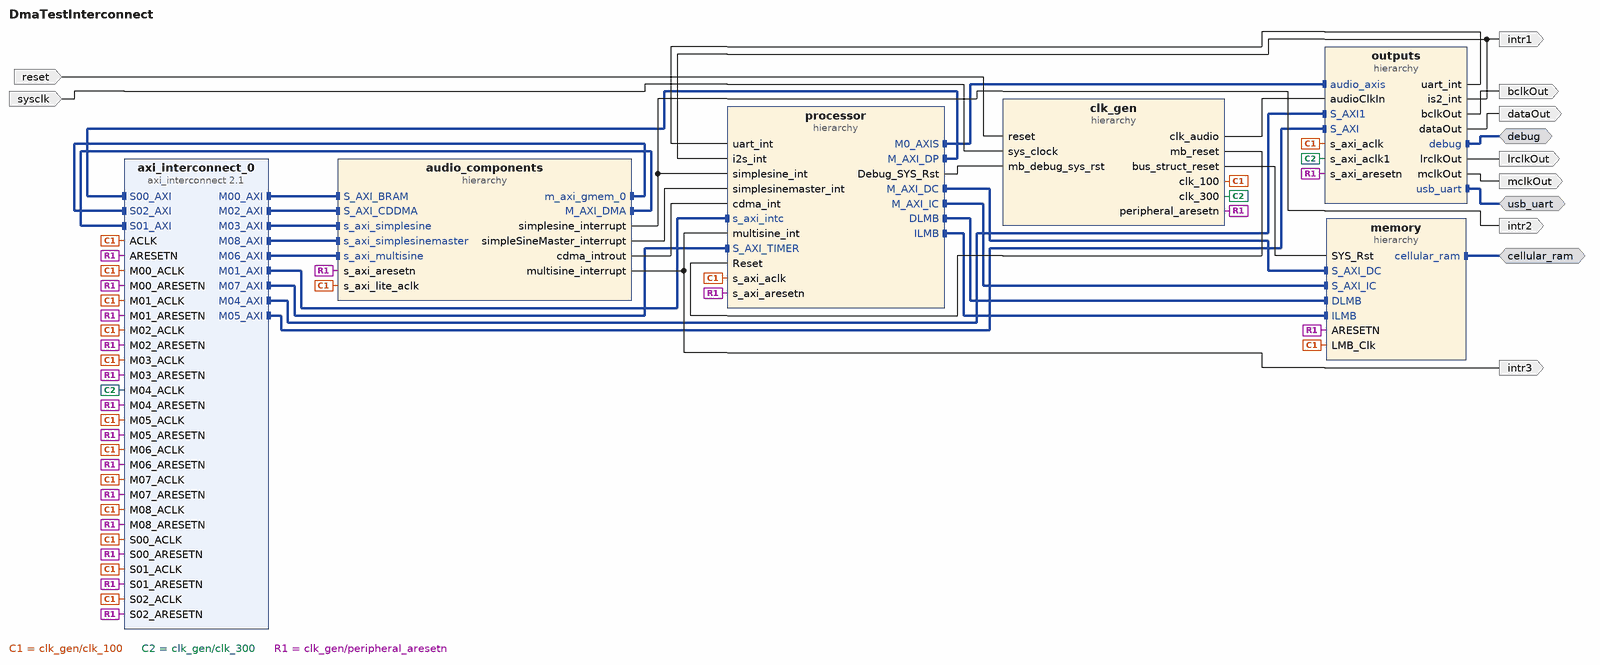
[diagram p0: block diagram of the top level]
# Vivado block design DmaTestInterconnect, xc7a35tcpg236-1, Vivado 2024.2
create_bd_design DmaTestInterconnect

create_bd_intf_port -mode Master -vlnv xilinx.com:interface:uart_rtl:1.0 usb_uart
create_bd_intf_port -mode Master -vlnv xilinx.com:interface:emc_rtl:1.0 cellular_ram
create_bd_intf_port -mode Master -vlnv xilinx.com:interface:gpio_rtl:1.0 debug
create_bd_port -dir I -type rst reset
set_property -dict {CONFIG.POLARITY ACTIVE_HIGH} [get_bd_ports reset]
create_bd_port -dir I -type clk sysclk
set_property -dict {CONFIG.FREQ_HZ 12000000 CONFIG.PHASE 0.0} [get_bd_ports sysclk]
create_bd_port -dir O mclkOut
create_bd_port -dir O bclkOut
create_bd_port -dir O lrclkOut
create_bd_port -dir O dataOut
create_bd_port -dir O intr1
create_bd_port -dir O intr2
create_bd_port -dir O intr3

create_bd_cell -type hier memory
create_bd_cell -type hier audio_components
create_bd_cell -type hier clk_gen
create_bd_cell -type ip -vlnv xilinx.com:ip:axi_interconnect:2.1 axi_interconnect_0
set_property -dict {CONFIG.ENABLE_ADVANCED_OPTIONS 1 CONFIG.NUM_MI 9 CONFIG.NUM_SI 3} [get_bd_cells axi_interconnect_0]
create_bd_cell -type hier outputs
create_bd_cell -type hier processor

# ---- hierarchy /memory ----
current_bd_instance /memory
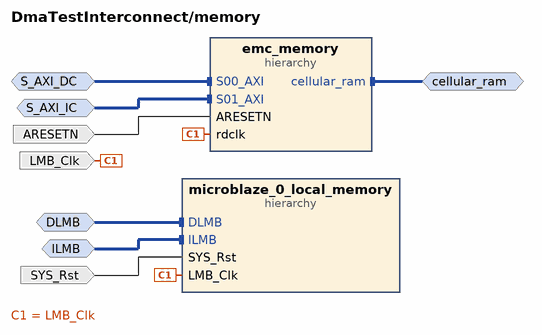
[diagram p1: block diagram inside /memory]
create_bd_intf_pin -mode Master -vlnv xilinx.com:interface:emc_rtl:1.0 cellular_ram
create_bd_intf_pin -mode Slave -vlnv xilinx.com:interface:aximm_rtl:1.0 S_AXI_DC
create_bd_intf_pin -mode Slave -vlnv xilinx.com:interface:aximm_rtl:1.0 S_AXI_IC
create_bd_intf_pin -mode MirroredMaster -vlnv xilinx.com:interface:lmb_rtl:1.0 DLMB
create_bd_intf_pin -mode MirroredMaster -vlnv xilinx.com:interface:lmb_rtl:1.0 ILMB
create_bd_pin -dir I -type clk LMB_Clk
create_bd_pin -dir I -type rst ARESETN
create_bd_pin -dir I -type rst SYS_Rst

create_bd_cell -type hier emc_memory
create_bd_cell -type hier microblaze_0_local_memory

# ---- hierarchy /memory/emc_memory ----
current_bd_instance /memory/emc_memory
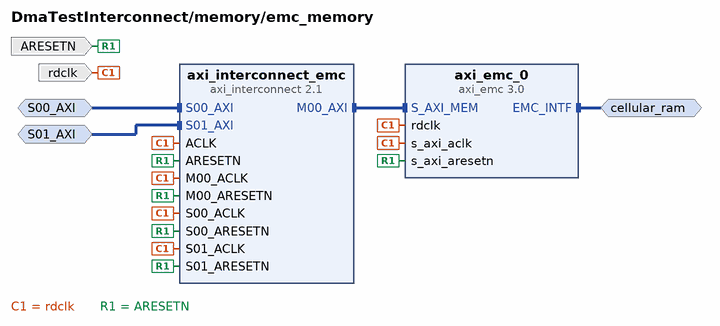
[diagram p2: block diagram inside /memory/emc_memory]
create_bd_intf_pin -mode Master -vlnv xilinx.com:interface:emc_rtl:1.0 cellular_ram
create_bd_intf_pin -mode Slave -vlnv xilinx.com:interface:aximm_rtl:1.0 S00_AXI
create_bd_intf_pin -mode Slave -vlnv xilinx.com:interface:aximm_rtl:1.0 S01_AXI
create_bd_pin -dir I -type clk rdclk
create_bd_pin -dir I -type rst ARESETN

create_bd_cell -type ip -vlnv xilinx.com:ip:axi_emc:3.0 axi_emc_0
set_property -dict {CONFIG.EMC_BOARD_INTERFACE cellular_ram CONFIG.USE_BOARD_FLOW true} [get_bd_cells axi_emc_0]
create_bd_cell -type ip -vlnv xilinx.com:ip:axi_interconnect:2.1 axi_interconnect_emc
set_property -dict {CONFIG.NUM_MI 1 CONFIG.NUM_SI 2} [get_bd_cells axi_interconnect_emc]

# ---- hierarchy /memory/microblaze_0_local_memory ----
current_bd_instance /memory/microblaze_0_local_memory
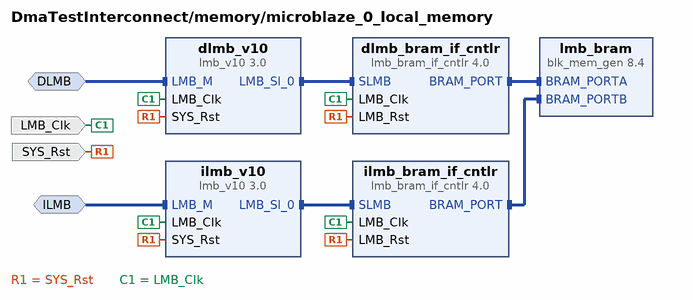
[diagram p3: block diagram inside /memory/microblaze_0_local_memory]
create_bd_intf_pin -mode MirroredMaster -vlnv xilinx.com:interface:lmb_rtl:1.0 DLMB
create_bd_intf_pin -mode MirroredMaster -vlnv xilinx.com:interface:lmb_rtl:1.0 ILMB
create_bd_pin -dir I -type clk LMB_Clk
create_bd_pin -dir I -type rst SYS_Rst

create_bd_cell -type ip -vlnv xilinx.com:ip:lmb_v10:3.0 dlmb_v10
create_bd_cell -type ip -vlnv xilinx.com:ip:lmb_v10:3.0 ilmb_v10
create_bd_cell -type ip -vlnv xilinx.com:ip:lmb_bram_if_cntlr:4.0 dlmb_bram_if_cntlr
set_property -dict {CONFIG.C_ECC 0 CONFIG.C_NUM_LMB 1} [get_bd_cells dlmb_bram_if_cntlr]
create_bd_cell -type ip -vlnv xilinx.com:ip:lmb_bram_if_cntlr:4.0 ilmb_bram_if_cntlr
set_property -dict {CONFIG.C_ECC 0} [get_bd_cells ilmb_bram_if_cntlr]
create_bd_cell -type ip -vlnv xilinx.com:ip:blk_mem_gen:8.4 lmb_bram
set_property -dict {CONFIG.Memory_Type True_Dual_Port_RAM CONFIG.use_bram_block BRAM_Controller} [get_bd_cells lmb_bram]

# ---- hierarchy /audio_components ----
current_bd_instance /audio_components
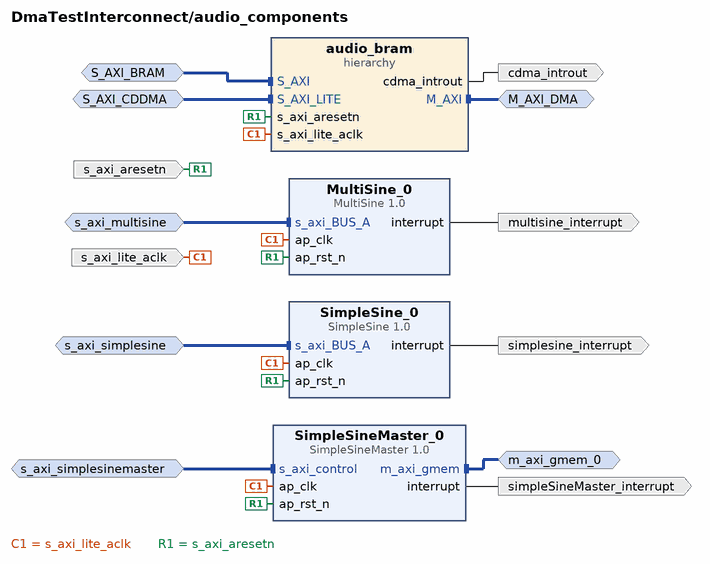
[diagram p4: block diagram inside /audio_components]
create_bd_intf_pin -mode Slave -vlnv xilinx.com:interface:aximm_rtl:1.0 s_axi_simplesine
create_bd_intf_pin -mode Master -vlnv xilinx.com:interface:aximm_rtl:1.0 M_AXI_DMA
create_bd_intf_pin -mode Slave -vlnv xilinx.com:interface:aximm_rtl:1.0 S_AXI_CDDMA
create_bd_intf_pin -mode Slave -vlnv xilinx.com:interface:aximm_rtl:1.0 S_AXI_BRAM
create_bd_intf_pin -mode Slave -vlnv xilinx.com:interface:aximm_rtl:1.0 s_axi_multisine
create_bd_intf_pin -mode Master -vlnv xilinx.com:interface:aximm_rtl:1.0 m_axi_gmem_0
create_bd_intf_pin -mode Slave -vlnv xilinx.com:interface:aximm_rtl:1.0 s_axi_simplesinemaster
create_bd_pin -dir I -type clk s_axi_lite_aclk
create_bd_pin -dir I -type rst s_axi_aresetn
create_bd_pin -dir O -type intr simplesine_interrupt
create_bd_pin -dir O -type intr cdma_introut
create_bd_pin -dir O -type intr multisine_interrupt
create_bd_pin -dir O simpleSineMaster_interrupt

create_bd_cell -type ip -vlnv xilinx.com:hls:SimpleSine:1.0 SimpleSine_0
create_bd_cell -type hier audio_bram
create_bd_cell -type ip -vlnv xilinx.com:hls:MultiSine:1.0 MultiSine_0
create_bd_cell -type ip -vlnv xilinx.com:hls:SimpleSineMaster:1.0 SimpleSineMaster_0

# ---- hierarchy /audio_components/audio_bram ----
current_bd_instance /audio_components/audio_bram
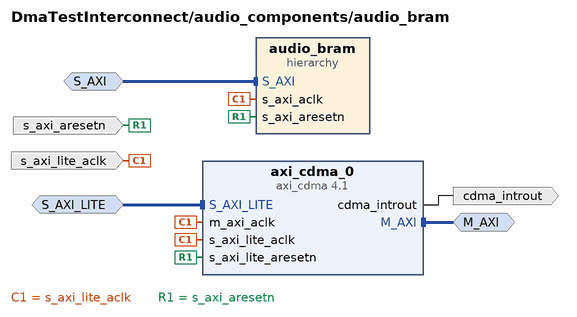
[diagram p5: block diagram inside /audio_components/audio_bram]
create_bd_intf_pin -mode Master -vlnv xilinx.com:interface:aximm_rtl:1.0 M_AXI
create_bd_intf_pin -mode Slave -vlnv xilinx.com:interface:aximm_rtl:1.0 S_AXI_LITE
create_bd_intf_pin -mode Slave -vlnv xilinx.com:interface:aximm_rtl:1.0 S_AXI
create_bd_pin -dir I -type clk s_axi_lite_aclk
create_bd_pin -dir I -type rst s_axi_aresetn
create_bd_pin -dir O -type intr cdma_introut

create_bd_cell -type ip -vlnv xilinx.com:ip:axi_cdma:4.1 axi_cdma_0
set_property -dict {CONFIG.C_INCLUDE_SG 0} [get_bd_cells axi_cdma_0]
create_bd_cell -type hier audio_bram

# ---- hierarchy /audio_components/audio_bram/audio_bram ----
current_bd_instance /audio_components/audio_bram/audio_bram
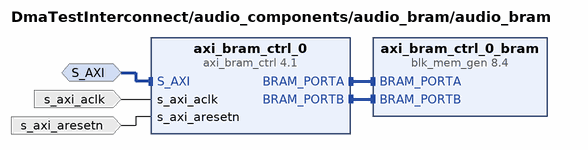
[diagram p6: block diagram inside /audio_components/audio_bram/audio_bram]
create_bd_intf_pin -mode Slave -vlnv xilinx.com:interface:aximm_rtl:1.0 S_AXI
create_bd_pin -dir I -type clk s_axi_aclk
create_bd_pin -dir I -type rst s_axi_aresetn

create_bd_cell -type ip -vlnv xilinx.com:ip:axi_bram_ctrl:4.1 axi_bram_ctrl_0
create_bd_cell -type ip -vlnv xilinx.com:ip:blk_mem_gen:8.4 axi_bram_ctrl_0_bram
set_property -dict {CONFIG.Memory_Type True_Dual_Port_RAM} [get_bd_cells axi_bram_ctrl_0_bram]

# ---- hierarchy /clk_gen ----
current_bd_instance /clk_gen
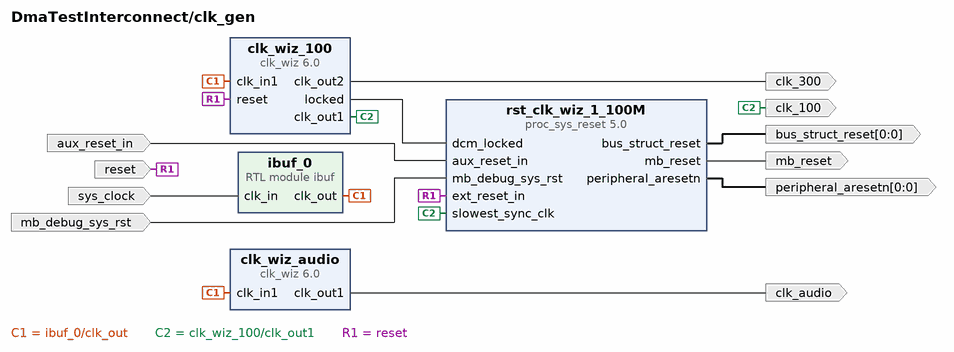
[diagram p7: block diagram inside /clk_gen]
create_bd_pin -dir I -type rst reset
create_bd_pin -dir O -type clk clk_100
create_bd_pin -dir I -type clk sys_clock
create_bd_pin -dir I -type rst mb_debug_sys_rst
create_bd_pin -dir O -type rst mb_reset
create_bd_pin -dir O -from 0 -to 0 -type rst bus_struct_reset
create_bd_pin -dir O -from 0 -to 0 -type rst peripheral_aresetn
create_bd_pin -dir O -type clk clk_audio
create_bd_pin -dir I -type rst aux_reset_in
create_bd_pin -dir O -type clk clk_300

create_bd_cell -type ip -vlnv xilinx.com:ip:clk_wiz:6.0 clk_wiz_100
set_property -dict [list \
  CONFIG.CLKIN1_JITTER_PS 833.33 \
  CONFIG.CLKOUT1_JITTER 571.161 \
  CONFIG.CLKOUT1_PHASE_ERROR 613.025 \
  CONFIG.CLKOUT2_JITTER 496.412 \
  CONFIG.CLKOUT2_PHASE_ERROR 613.025 \
  CONFIG.CLKOUT2_REQUESTED_OUT_FREQ 300.000 \
  CONFIG.CLKOUT2_USED true \
  CONFIG.CLK_IN1_BOARD_INTERFACE Custom \
  CONFIG.MMCM_CLKFBOUT_MULT_F 50.000 \
  CONFIG.MMCM_CLKIN1_PERIOD 83.333 \
  CONFIG.MMCM_CLKIN2_PERIOD 10.0 \
  CONFIG.MMCM_CLKOUT0_DIVIDE_F 6.000 \
  CONFIG.MMCM_CLKOUT1_DIVIDE 2 \
  CONFIG.NUM_OUT_CLKS 2 \
  CONFIG.PRIM_SOURCE No_buffer \
  CONFIG.RESET_BOARD_INTERFACE reset \
  CONFIG.USE_BOARD_FLOW true \
] [get_bd_cells clk_wiz_100]
create_bd_cell -type module -reference ibuf ibuf_0
create_bd_cell -type ip -vlnv xilinx.com:ip:proc_sys_reset:5.0 rst_clk_wiz_1_100M
set_property -dict {CONFIG.RESET_BOARD_INTERFACE reset CONFIG.USE_BOARD_FLOW true} [get_bd_cells rst_clk_wiz_1_100M]
create_bd_cell -type ip -vlnv xilinx.com:ip:clk_wiz:6.0 clk_wiz_audio
set_property -dict [list \
  CONFIG.CLKIN1_JITTER_PS 833.33 \
  CONFIG.CLKOUT1_JITTER 598.000 \
  CONFIG.CLKOUT1_PHASE_ERROR 693.818 \
  CONFIG.CLKOUT1_REQUESTED_OUT_FREQ 24.576 \
  CONFIG.MMCM_CLKFBOUT_MULT_F 64.000 \
  CONFIG.MMCM_CLKIN1_PERIOD 83.333 \
  CONFIG.MMCM_CLKIN2_PERIOD 10.0 \
  CONFIG.MMCM_CLKOUT0_DIVIDE_F 31.250 \
  CONFIG.PRIM_IN_FREQ 12 \
  CONFIG.PRIM_SOURCE No_buffer \
  CONFIG.USE_LOCKED false \
  CONFIG.USE_RESET false \
] [get_bd_cells clk_wiz_audio]

# ---- hierarchy /outputs ----
current_bd_instance /outputs
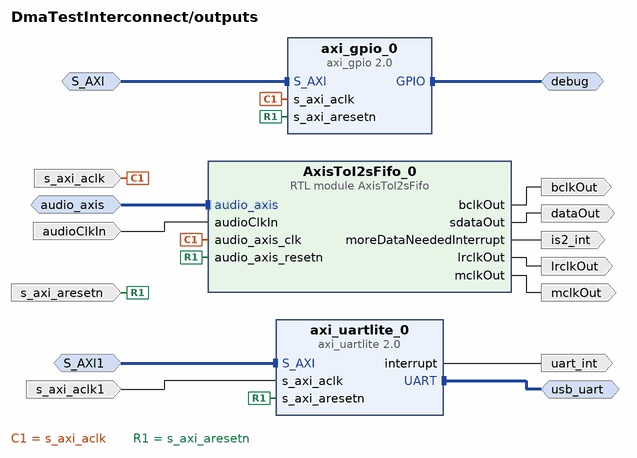
[diagram p8: block diagram inside /outputs]
create_bd_intf_pin -mode Slave -vlnv xilinx.com:interface:axis_rtl:1.0 audio_axis
create_bd_intf_pin -mode Slave -vlnv xilinx.com:interface:aximm_rtl:1.0 S_AXI
create_bd_intf_pin -mode Master -vlnv xilinx.com:interface:gpio_rtl:1.0 debug
create_bd_intf_pin -mode Slave -vlnv xilinx.com:interface:aximm_rtl:1.0 S_AXI1
create_bd_intf_pin -mode Master -vlnv xilinx.com:interface:uart_rtl:1.0 usb_uart
create_bd_pin -dir I -type clk s_axi_aclk
create_bd_pin -dir I -type rst s_axi_aresetn
create_bd_pin -dir I audioClkIn
create_bd_pin -dir O mclkOut
create_bd_pin -dir O bclkOut
create_bd_pin -dir O lrclkOut
create_bd_pin -dir O dataOut
create_bd_pin -dir O is2_int
create_bd_pin -dir I -type clk s_axi_aclk1
create_bd_pin -dir O -type intr uart_int

create_bd_cell -type module -reference AxisToI2sFifo AxisToI2sFifo_0
set_property -dict {CONFIG.FIFO_SAMPLE_DEPTH 256 CONFIG.FIFO_SAMPLE_MAINTAIN_DEPTH 96} [get_bd_cells AxisToI2sFifo_0]
create_bd_cell -type ip -vlnv xilinx.com:ip:axi_gpio:2.0 axi_gpio_0
set_property -dict {CONFIG.C_GPIO_WIDTH 8 CONFIG.GPIO_BOARD_INTERFACE Custom CONFIG.USE_BOARD_FLOW true} [get_bd_cells axi_gpio_0]
create_bd_cell -type ip -vlnv xilinx.com:ip:axi_uartlite:2.0 axi_uartlite_0
set_property -dict [list \
  CONFIG.C_BAUDRATE 921600 \
  CONFIG.C_S_AXI_ACLK_FREQ_HZ_d 300.0 \
  CONFIG.UARTLITE_BOARD_INTERFACE usb_uart \
  CONFIG.USE_BOARD_FLOW true \
] [get_bd_cells axi_uartlite_0]

# ---- hierarchy /processor ----
current_bd_instance /processor
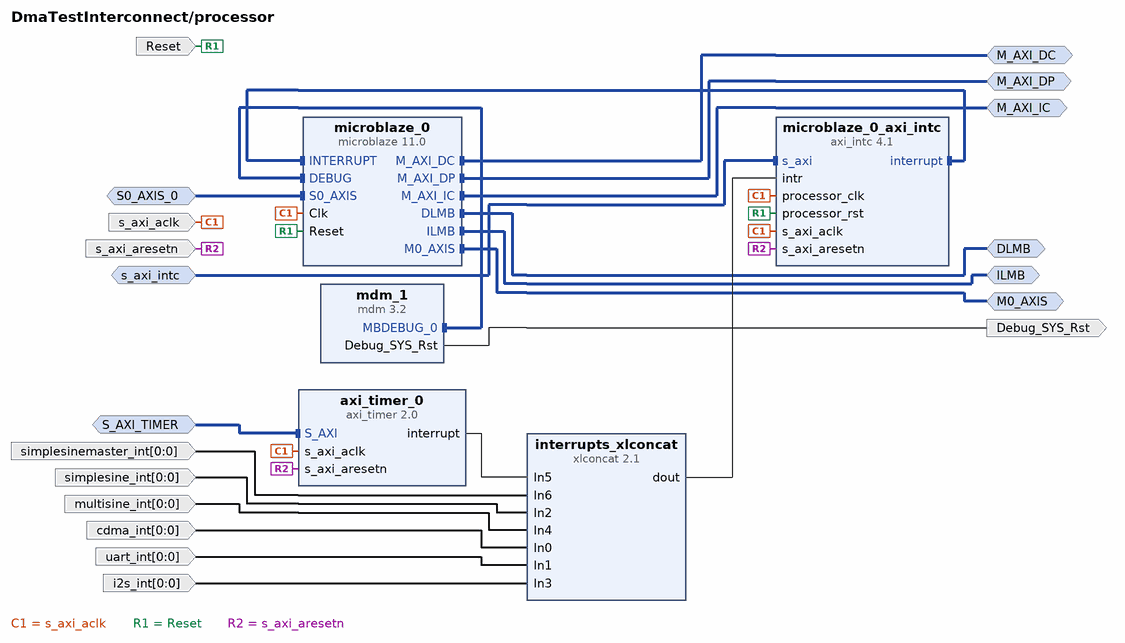
[diagram p9: block diagram inside /processor]
create_bd_intf_pin -mode Slave -vlnv xilinx.com:interface:aximm_rtl:1.0 s_axi_intc
create_bd_intf_pin -mode Slave -vlnv xilinx.com:interface:aximm_rtl:1.0 S_AXI_TIMER
create_bd_intf_pin -mode Master -vlnv xilinx.com:interface:lmb_rtl:1.0 DLMB
create_bd_intf_pin -mode Master -vlnv xilinx.com:interface:lmb_rtl:1.0 ILMB
create_bd_intf_pin -mode Master -vlnv xilinx.com:interface:aximm_rtl:1.0 M_AXI_DP
create_bd_intf_pin -mode Master -vlnv xilinx.com:interface:axis_rtl:1.0 M0_AXIS
create_bd_intf_pin -mode Master -vlnv xilinx.com:interface:aximm_rtl:1.0 M_AXI_DC
create_bd_intf_pin -mode Master -vlnv xilinx.com:interface:aximm_rtl:1.0 M_AXI_IC
create_bd_intf_pin -mode Slave -vlnv xilinx.com:interface:axis_rtl:1.0 S0_AXIS_0
create_bd_pin -dir I -type clk s_axi_aclk
create_bd_pin -dir I -type rst s_axi_aresetn
create_bd_pin -dir I -type rst Reset
create_bd_pin -dir O -type rst Debug_SYS_Rst
create_bd_pin -dir I -from 0 -to 0 cdma_int
create_bd_pin -dir I -from 0 -to 0 uart_int
create_bd_pin -dir I -from 0 -to 0 simplesine_int
create_bd_pin -dir I -from 0 -to 0 i2s_int
create_bd_pin -dir I -from 0 -to 0 multisine_int
create_bd_pin -dir I -from 0 -to 0 simplesinemaster_int

create_bd_cell -type ip -vlnv xilinx.com:ip:axi_intc:4.1 microblaze_0_axi_intc
set_property -dict {CONFIG.C_HAS_FAST 1} [get_bd_cells microblaze_0_axi_intc]
create_bd_cell -type ip -vlnv xilinx.com:ip:mdm:3.2 mdm_1
create_bd_cell -type ip -vlnv xilinx.com:ip:axi_timer:2.0 axi_timer_0
create_bd_cell -type ip -vlnv xilinx.com:ip:xlconcat:2.1 interrupts_xlconcat
set_property -dict {CONFIG.NUM_PORTS 7} [get_bd_cells interrupts_xlconcat]
create_bd_cell -type ip -vlnv xilinx.com:ip:microblaze:11.0 microblaze_0
set_property -dict [list \
  CONFIG.C_CACHE_BYTE_SIZE 32768 \
  CONFIG.C_DCACHE_BYTE_SIZE 32768 \
  CONFIG.C_DCACHE_USE_WRITEBACK 1 \
  CONFIG.C_DCACHE_VICTIMS 8 \
  CONFIG.C_DEBUG_ENABLED 2 \
  CONFIG.C_DEBUG_EXTERNAL_TRACE 0 \
  CONFIG.C_DEBUG_PROFILE_SIZE 16384 \
  CONFIG.C_DIV_ZERO_EXCEPTION 1 \
  CONFIG.C_D_AXI 1 \
  CONFIG.C_D_LMB 1 \
  CONFIG.C_ENABLE_CONVERSION 0 \
  CONFIG.C_FSL_LINKS 1 \
  CONFIG.C_ICACHE_STREAMS 1 \
  CONFIG.C_ICACHE_VICTIMS 8 \
  CONFIG.C_ILL_OPCODE_EXCEPTION 1 \
  CONFIG.C_I_LMB 1 \
  CONFIG.C_M_AXI_D_BUS_EXCEPTION 1 \
  CONFIG.C_M_AXI_I_BUS_EXCEPTION 1 \
  CONFIG.C_NUMBER_OF_PC_BRK 8 \
  CONFIG.C_NUMBER_OF_WR_ADDR_BRK 2 \
  CONFIG.C_OPCODE_0x0_ILLEGAL 1 \
  CONFIG.C_UNALIGNED_EXCEPTIONS 1 \
  CONFIG.C_USE_BARREL 1 \
  CONFIG.C_USE_BRANCH_TARGET_CACHE 1 \
  CONFIG.C_USE_DCACHE 1 \
  CONFIG.C_USE_DIV 1 \
  CONFIG.C_USE_FPU 2 \
  CONFIG.C_USE_HW_MUL 1 \
  CONFIG.C_USE_ICACHE 1 \
  CONFIG.C_USE_MSR_INSTR 1 \
  CONFIG.C_USE_PCMP_INSTR 1 \
  CONFIG.C_USE_STACK_PROTECTION 1 \
] [get_bd_cells microblaze_0]

# ---- connections ----

current_bd_instance /memory
connect_bd_intf_net -intf_net axi_emc_0_EMC_INTF [get_bd_intf_pins cellular_ram] [get_bd_intf_pins emc_memory/cellular_ram]
connect_bd_intf_net -intf_net microblaze_0_M_AXI_DC [get_bd_intf_pins S_AXI_DC] [get_bd_intf_pins emc_memory/S00_AXI]
connect_bd_intf_net -intf_net microblaze_0_M_AXI_IC [get_bd_intf_pins S_AXI_IC] [get_bd_intf_pins emc_memory/S01_AXI]
connect_bd_intf_net -intf_net microblaze_0_dlmb_1 [get_bd_intf_pins DLMB] [get_bd_intf_pins microblaze_0_local_memory/DLMB]
connect_bd_intf_net -intf_net microblaze_0_ilmb_1 [get_bd_intf_pins ILMB] [get_bd_intf_pins microblaze_0_local_memory/ILMB]
connect_bd_net -net microblaze_0_Clk [get_bd_pins LMB_Clk] [get_bd_pins microblaze_0_local_memory/LMB_Clk] [get_bd_pins emc_memory/rdclk]
connect_bd_net -net rst_clk_wiz_1_100M_bus_struct_reset [get_bd_pins SYS_Rst] [get_bd_pins microblaze_0_local_memory/SYS_Rst]
connect_bd_net -net rst_clk_wiz_1_100M_peripheral_aresetn [get_bd_pins ARESETN] [get_bd_pins emc_memory/ARESETN]

current_bd_instance /memory/emc_memory
connect_bd_intf_net [get_bd_intf_pins cellular_ram] [get_bd_intf_pins axi_emc_0/EMC_INTF]
connect_bd_intf_net -intf_net axi_interconnect_1_M00_AXI [get_bd_intf_pins axi_emc_0/S_AXI_MEM] [get_bd_intf_pins axi_interconnect_emc/M00_AXI]
connect_bd_intf_net -intf_net microblaze_0_M_AXI_DC [get_bd_intf_pins S00_AXI] [get_bd_intf_pins axi_interconnect_emc/S00_AXI]
connect_bd_intf_net -intf_net microblaze_0_M_AXI_IC [get_bd_intf_pins S01_AXI] [get_bd_intf_pins axi_interconnect_emc/S01_AXI]
connect_bd_net -net microblaze_0_Clk [get_bd_pins rdclk] \
  [get_bd_pins axi_emc_0/rdclk] [get_bd_pins axi_interconnect_emc/ACLK] [get_bd_pins axi_interconnect_emc/M00_ACLK] \
  [get_bd_pins axi_interconnect_emc/S00_ACLK] [get_bd_pins axi_interconnect_emc/S01_ACLK] [get_bd_pins axi_emc_0/s_axi_aclk]
connect_bd_net -net rst_clk_wiz_1_100M_peripheral_aresetn [get_bd_pins ARESETN] \
  [get_bd_pins axi_interconnect_emc/ARESETN] [get_bd_pins axi_interconnect_emc/M00_ARESETN] \
  [get_bd_pins axi_interconnect_emc/S00_ARESETN] [get_bd_pins axi_interconnect_emc/S01_ARESETN] \
  [get_bd_pins axi_emc_0/s_axi_aresetn]

current_bd_instance /memory/microblaze_0_local_memory
connect_bd_intf_net [get_bd_intf_pins ilmb_v10/LMB_Sl_0] [get_bd_intf_pins ilmb_bram_if_cntlr/SLMB]
connect_bd_intf_net -intf_net microblaze_0_dlmb [get_bd_intf_pins dlmb_v10/LMB_M] [get_bd_intf_pins DLMB]
connect_bd_intf_net -intf_net microblaze_0_dlmb_bus [get_bd_intf_pins dlmb_v10/LMB_Sl_0] [get_bd_intf_pins dlmb_bram_if_cntlr/SLMB]
connect_bd_intf_net -intf_net microblaze_0_dlmb_cntlr [get_bd_intf_pins dlmb_bram_if_cntlr/BRAM_PORT] [get_bd_intf_pins lmb_bram/BRAM_PORTA]
connect_bd_intf_net -intf_net microblaze_0_ilmb [get_bd_intf_pins ilmb_v10/LMB_M] [get_bd_intf_pins ILMB]
connect_bd_intf_net -intf_net microblaze_0_ilmb_cntlr [get_bd_intf_pins ilmb_bram_if_cntlr/BRAM_PORT] [get_bd_intf_pins lmb_bram/BRAM_PORTB]
connect_bd_net [get_bd_pins SYS_Rst] \
  [get_bd_pins dlmb_v10/SYS_Rst] [get_bd_pins dlmb_bram_if_cntlr/LMB_Rst] [get_bd_pins ilmb_v10/SYS_Rst] \
  [get_bd_pins ilmb_bram_if_cntlr/LMB_Rst]
connect_bd_net -net microblaze_0_Clk [get_bd_pins LMB_Clk] \
  [get_bd_pins dlmb_v10/LMB_Clk] [get_bd_pins dlmb_bram_if_cntlr/LMB_Clk] [get_bd_pins ilmb_v10/LMB_Clk] \
  [get_bd_pins ilmb_bram_if_cntlr/LMB_Clk]
set_property HDL_ATTRIBUTE.BMM_INFO_ADDRESS_SPACE {byte  0x00000000 32 > DmaTestInterconnect memory/microblaze_0_local_memory/lmb_bram} [get_bd_cells dlmb_bram_if_cntlr]
set_property HDL_ATTRIBUTE.KEEP_HIERARCHY yes [get_bd_cells dlmb_bram_if_cntlr]

current_bd_instance /audio_components
connect_bd_intf_net [get_bd_intf_pins SimpleSineMaster_0/m_axi_gmem] [get_bd_intf_pins m_axi_gmem_0]
connect_bd_intf_net [get_bd_intf_pins SimpleSineMaster_0/s_axi_control] [get_bd_intf_pins s_axi_simplesinemaster]
connect_bd_intf_net -intf_net axi_cdma_0_M_AXI [get_bd_intf_pins M_AXI_DMA] [get_bd_intf_pins audio_bram/M_AXI]
connect_bd_intf_net -intf_net axi_interconnect_0_M00_AXI [get_bd_intf_pins S_AXI_BRAM] [get_bd_intf_pins audio_bram/S_AXI]
connect_bd_intf_net -intf_net axi_interconnect_0_M02_AXI [get_bd_intf_pins S_AXI_CDDMA] [get_bd_intf_pins audio_bram/S_AXI_LITE]
connect_bd_intf_net -intf_net axi_interconnect_0_M03_AXI [get_bd_intf_pins s_axi_simplesine] [get_bd_intf_pins SimpleSine_0/s_axi_BUS_A]
connect_bd_intf_net [get_bd_intf_pins s_axi_multisine] [get_bd_intf_pins MultiSine_0/s_axi_BUS_A]
connect_bd_net [get_bd_pins MultiSine_0/interrupt] [get_bd_pins multisine_interrupt]
connect_bd_net [get_bd_pins SimpleSineMaster_0/interrupt] [get_bd_pins simpleSineMaster_interrupt]
connect_bd_net [get_bd_pins SimpleSine_0/interrupt] [get_bd_pins simplesine_interrupt]
connect_bd_net -net axi_cdma_0_cdma_introut [get_bd_pins audio_bram/cdma_introut] [get_bd_pins cdma_introut]
connect_bd_net -net microblaze_0_Clk [get_bd_pins s_axi_lite_aclk] \
  [get_bd_pins audio_bram/s_axi_lite_aclk] [get_bd_pins MultiSine_0/ap_clk] [get_bd_pins SimpleSine_0/ap_clk] \
  [get_bd_pins SimpleSineMaster_0/ap_clk]
connect_bd_net -net rst_clk_wiz_1_100M_peripheral_aresetn [get_bd_pins s_axi_aresetn] \
  [get_bd_pins audio_bram/s_axi_aresetn] [get_bd_pins MultiSine_0/ap_rst_n] [get_bd_pins SimpleSine_0/ap_rst_n] \
  [get_bd_pins SimpleSineMaster_0/ap_rst_n]

current_bd_instance /audio_components/audio_bram
connect_bd_intf_net [get_bd_intf_pins M_AXI] [get_bd_intf_pins axi_cdma_0/M_AXI]
connect_bd_intf_net -intf_net axi_interconnect_0_M00_AXI [get_bd_intf_pins S_AXI] [get_bd_intf_pins audio_bram/S_AXI]
connect_bd_intf_net -intf_net axi_interconnect_0_M02_AXI [get_bd_intf_pins S_AXI_LITE] [get_bd_intf_pins axi_cdma_0/S_AXI_LITE]
connect_bd_net [get_bd_pins axi_cdma_0/cdma_introut] [get_bd_pins cdma_introut]
connect_bd_net -net microblaze_0_Clk [get_bd_pins s_axi_lite_aclk] \
  [get_bd_pins axi_cdma_0/s_axi_lite_aclk] [get_bd_pins audio_bram/s_axi_aclk] [get_bd_pins axi_cdma_0/m_axi_aclk]
connect_bd_net -net rst_clk_wiz_1_100M_peripheral_aresetn [get_bd_pins s_axi_aresetn] \
  [get_bd_pins audio_bram/s_axi_aresetn] [get_bd_pins axi_cdma_0/s_axi_lite_aresetn]

current_bd_instance /audio_components/audio_bram/audio_bram
connect_bd_intf_net [get_bd_intf_pins axi_bram_ctrl_0_bram/BRAM_PORTA] [get_bd_intf_pins axi_bram_ctrl_0/BRAM_PORTA]
connect_bd_intf_net [get_bd_intf_pins axi_bram_ctrl_0_bram/BRAM_PORTB] [get_bd_intf_pins axi_bram_ctrl_0/BRAM_PORTB]
connect_bd_intf_net -intf_net axi_interconnect_0_M00_AXI [get_bd_intf_pins S_AXI] [get_bd_intf_pins axi_bram_ctrl_0/S_AXI]
connect_bd_net -net microblaze_0_Clk [get_bd_pins s_axi_aclk] [get_bd_pins axi_bram_ctrl_0/s_axi_aclk]
connect_bd_net -net rst_clk_wiz_1_100M_peripheral_aresetn [get_bd_pins s_axi_aresetn] [get_bd_pins axi_bram_ctrl_0/s_axi_aresetn]
set_property HDL_ATTRIBUTE.BMM_INFO_ADDRESS_SPACE {byte  0xC0000000 32 > DmaTestInterconnect audio_components/audio_bram/audio_bram/axi_bram_ctrl_0_bram} [get_bd_cells axi_bram_ctrl_0]
set_property HDL_ATTRIBUTE.KEEP_HIERARCHY yes [get_bd_cells axi_bram_ctrl_0]

current_bd_instance /clk_gen
connect_bd_net [get_bd_pins aux_reset_in] [get_bd_pins rst_clk_wiz_1_100M/aux_reset_in]
connect_bd_net -net clk_wiz_0_clk_out1 [get_bd_pins clk_wiz_audio/clk_out1] [get_bd_pins clk_audio]
connect_bd_net [get_bd_pins clk_wiz_100/clk_out2] [get_bd_pins clk_300]
connect_bd_net -net clk_wiz_1_locked [get_bd_pins clk_wiz_100/locked] [get_bd_pins rst_clk_wiz_1_100M/dcm_locked]
connect_bd_net [get_bd_pins ibuf_0/clk_out] [get_bd_pins clk_wiz_100/clk_in1] [get_bd_pins clk_wiz_audio/clk_in1]
connect_bd_net -net mdm_1_debug_sys_rst [get_bd_pins mb_debug_sys_rst] [get_bd_pins rst_clk_wiz_1_100M/mb_debug_sys_rst]
connect_bd_net -net microblaze_0_Clk [get_bd_pins clk_wiz_100/clk_out1] [get_bd_pins clk_100] [get_bd_pins rst_clk_wiz_1_100M/slowest_sync_clk]
connect_bd_net [get_bd_pins reset] [get_bd_pins rst_clk_wiz_1_100M/ext_reset_in] [get_bd_pins clk_wiz_100/reset]
connect_bd_net [get_bd_pins rst_clk_wiz_1_100M/bus_struct_reset] [get_bd_pins bus_struct_reset]
connect_bd_net [get_bd_pins rst_clk_wiz_1_100M/mb_reset] [get_bd_pins mb_reset]
connect_bd_net [get_bd_pins rst_clk_wiz_1_100M/peripheral_aresetn] [get_bd_pins peripheral_aresetn]
connect_bd_net [get_bd_pins sys_clock] [get_bd_pins ibuf_0/clk_in]

current_bd_instance /outputs
connect_bd_intf_net [get_bd_intf_pins debug] [get_bd_intf_pins axi_gpio_0/GPIO]
connect_bd_intf_net -intf_net axi_interconnect_0_M04_AXI [get_bd_intf_pins S_AXI1] [get_bd_intf_pins axi_uartlite_0/S_AXI]
connect_bd_intf_net -intf_net axi_interconnect_0_M05_AXI [get_bd_intf_pins S_AXI] [get_bd_intf_pins axi_gpio_0/S_AXI]
connect_bd_intf_net [get_bd_intf_pins usb_uart] [get_bd_intf_pins axi_uartlite_0/UART]
connect_bd_intf_net -intf_net processor_M0_AXIS [get_bd_intf_pins audio_axis] [get_bd_intf_pins AxisToI2sFifo_0/audio_axis]
connect_bd_net [get_bd_pins axi_uartlite_0/interrupt] [get_bd_pins uart_int]
connect_bd_net -net clk_gen_clk_100 [get_bd_pins s_axi_aclk] [get_bd_pins axi_gpio_0/s_axi_aclk] [get_bd_pins AxisToI2sFifo_0/audio_axis_clk]
connect_bd_net -net clk_gen_clk_300 [get_bd_pins s_axi_aclk1] [get_bd_pins axi_uartlite_0/s_axi_aclk]
connect_bd_net -net clk_gen_clk_audio [get_bd_pins audioClkIn] [get_bd_pins AxisToI2sFifo_0/audioClkIn]
connect_bd_net -net outputs_bclkOut_0 [get_bd_pins AxisToI2sFifo_0/bclkOut] [get_bd_pins bclkOut]
connect_bd_net -net outputs_lrclkOut_0 [get_bd_pins AxisToI2sFifo_0/lrclkOut] [get_bd_pins lrclkOut]
connect_bd_net -net outputs_mclkOut_2 [get_bd_pins AxisToI2sFifo_0/mclkOut] [get_bd_pins mclkOut]
connect_bd_net -net outputs_moreDataNeededInterrupt_0 [get_bd_pins AxisToI2sFifo_0/moreDataNeededInterrupt] [get_bd_pins is2_int]
connect_bd_net -net outputs_sdataOut_0 [get_bd_pins AxisToI2sFifo_0/sdataOut] [get_bd_pins dataOut]
connect_bd_net -net rst_clk_wiz_1_100M_peripheral_aresetn [get_bd_pins s_axi_aresetn] \
  [get_bd_pins axi_gpio_0/s_axi_aresetn] [get_bd_pins axi_uartlite_0/s_axi_aresetn] \
  [get_bd_pins AxisToI2sFifo_0/audio_axis_resetn]

current_bd_instance /processor
connect_bd_intf_net [get_bd_intf_pins microblaze_0/S0_AXIS] [get_bd_intf_pins S0_AXIS_0]
connect_bd_intf_net -intf_net axi_interconnect_0_M01_AXI [get_bd_intf_pins s_axi_intc] [get_bd_intf_pins microblaze_0_axi_intc/s_axi]
connect_bd_intf_net -intf_net interconnect_M07_AXI [get_bd_intf_pins S_AXI_TIMER] [get_bd_intf_pins axi_timer_0/S_AXI]
connect_bd_intf_net [get_bd_intf_pins M_AXI_DC] [get_bd_intf_pins microblaze_0/M_AXI_DC]
connect_bd_intf_net [get_bd_intf_pins M_AXI_DP] [get_bd_intf_pins microblaze_0/M_AXI_DP]
connect_bd_intf_net [get_bd_intf_pins M_AXI_IC] [get_bd_intf_pins microblaze_0/M_AXI_IC]
connect_bd_intf_net [get_bd_intf_pins mdm_1/MBDEBUG_0] [get_bd_intf_pins microblaze_0/DEBUG]
connect_bd_intf_net [get_bd_intf_pins DLMB] [get_bd_intf_pins microblaze_0/DLMB]
connect_bd_intf_net [get_bd_intf_pins ILMB] [get_bd_intf_pins microblaze_0/ILMB]
connect_bd_intf_net [get_bd_intf_pins microblaze_0_axi_intc/interrupt] [get_bd_intf_pins microblaze_0/INTERRUPT]
connect_bd_intf_net -intf_net processor_M0_AXIS [get_bd_intf_pins M0_AXIS] [get_bd_intf_pins microblaze_0/M0_AXIS]
connect_bd_net -net In6_0_1 [get_bd_pins simplesinemaster_int] [get_bd_pins interrupts_xlconcat/In6]
connect_bd_net -net SimpleSine_0_interrupt [get_bd_pins simplesine_int] [get_bd_pins interrupts_xlconcat/In2]
connect_bd_net -net audio_components_multisine_interrupt [get_bd_pins multisine_int] [get_bd_pins interrupts_xlconcat/In4]
connect_bd_net -net axi_cdma_0_cdma_introut [get_bd_pins cdma_int] [get_bd_pins interrupts_xlconcat/In0]
connect_bd_net [get_bd_pins axi_timer_0/interrupt] [get_bd_pins interrupts_xlconcat/In5]
connect_bd_net -net axi_uartlite_0_interrupt [get_bd_pins uart_int] [get_bd_pins interrupts_xlconcat/In1]
connect_bd_net -net clk_gen_clk_100 [get_bd_pins s_axi_aclk] \
  [get_bd_pins axi_timer_0/s_axi_aclk] [get_bd_pins microblaze_0/Clk] [get_bd_pins microblaze_0_axi_intc/processor_clk] \
  [get_bd_pins microblaze_0_axi_intc/s_axi_aclk]
connect_bd_net [get_bd_pins mdm_1/Debug_SYS_Rst] [get_bd_pins Debug_SYS_Rst]
connect_bd_net -net microblaze_0_intr [get_bd_pins interrupts_xlconcat/dout] [get_bd_pins microblaze_0_axi_intc/intr]
connect_bd_net -net outputs_moreDataNeededInterrupt_0 [get_bd_pins i2s_int] [get_bd_pins interrupts_xlconcat/In3]
connect_bd_net -net rst_clk_wiz_1_100M_mb_reset [get_bd_pins Reset] [get_bd_pins microblaze_0/Reset] [get_bd_pins microblaze_0_axi_intc/processor_rst]
connect_bd_net -net rst_clk_wiz_1_100M_peripheral_aresetn [get_bd_pins s_axi_aresetn] \
  [get_bd_pins axi_timer_0/s_axi_aresetn] [get_bd_pins microblaze_0_axi_intc/s_axi_aresetn]
set_property HDL_ATTRIBUTE.BMM_INFO_PROCESSOR {microblaze-le > DmaTestInterconnect memory/microblaze_0_local_memory/dlmb_bram_if_cntlr DmaTestInterconnect audio_components/audio_bram/audio_bram/axi_bram_ctrl_0} [get_bd_cells microblaze_0]
set_property HDL_ATTRIBUTE.KEEP_HIERARCHY yes [get_bd_cells microblaze_0]

current_bd_instance /
connect_bd_intf_net [get_bd_intf_pins audio_components/m_axi_gmem_0] [get_bd_intf_pins axi_interconnect_0/S02_AXI]
connect_bd_intf_net -intf_net axi_cdma_0_M_AXI [get_bd_intf_pins audio_components/M_AXI_DMA] [get_bd_intf_pins axi_interconnect_0/S01_AXI]
connect_bd_intf_net -intf_net axi_emc_0_EMC_INTF [get_bd_intf_ports cellular_ram] [get_bd_intf_pins memory/cellular_ram]
connect_bd_intf_net -intf_net axi_gpio_0_GPIO [get_bd_intf_ports debug] [get_bd_intf_pins outputs/debug]
connect_bd_intf_net [get_bd_intf_pins audio_components/S_AXI_BRAM] [get_bd_intf_pins axi_interconnect_0/M00_AXI]
connect_bd_intf_net [get_bd_intf_pins processor/s_axi_intc] [get_bd_intf_pins axi_interconnect_0/M01_AXI]
connect_bd_intf_net [get_bd_intf_pins audio_components/S_AXI_CDDMA] [get_bd_intf_pins axi_interconnect_0/M02_AXI]
connect_bd_intf_net [get_bd_intf_pins audio_components/s_axi_simplesine] [get_bd_intf_pins axi_interconnect_0/M03_AXI]
connect_bd_intf_net [get_bd_intf_pins outputs/S_AXI1] [get_bd_intf_pins axi_interconnect_0/M04_AXI]
connect_bd_intf_net [get_bd_intf_pins outputs/S_AXI] [get_bd_intf_pins axi_interconnect_0/M05_AXI]
connect_bd_intf_net [get_bd_intf_pins axi_interconnect_0/M08_AXI] [get_bd_intf_pins audio_components/s_axi_simplesinemaster]
connect_bd_intf_net -intf_net axi_uartlite_0_UART [get_bd_intf_ports usb_uart] [get_bd_intf_pins outputs/usb_uart]
connect_bd_intf_net -intf_net interconnect_M07_AXI [get_bd_intf_pins processor/S_AXI_TIMER] [get_bd_intf_pins axi_interconnect_0/M07_AXI]
connect_bd_intf_net -intf_net microblaze_0_M_AXI_DC [get_bd_intf_pins processor/M_AXI_DC] [get_bd_intf_pins memory/S_AXI_DC]
connect_bd_intf_net -intf_net microblaze_0_M_AXI_DP [get_bd_intf_pins processor/M_AXI_DP] [get_bd_intf_pins axi_interconnect_0/S00_AXI]
connect_bd_intf_net -intf_net microblaze_0_M_AXI_IC [get_bd_intf_pins processor/M_AXI_IC] [get_bd_intf_pins memory/S_AXI_IC]
connect_bd_intf_net -intf_net microblaze_0_dlmb_1 [get_bd_intf_pins processor/DLMB] [get_bd_intf_pins memory/DLMB]
connect_bd_intf_net -intf_net microblaze_0_ilmb_1 [get_bd_intf_pins processor/ILMB] [get_bd_intf_pins memory/ILMB]
connect_bd_intf_net [get_bd_intf_pins processor/M0_AXIS] [get_bd_intf_pins outputs/audio_axis]
connect_bd_intf_net [get_bd_intf_pins audio_components/s_axi_multisine] [get_bd_intf_pins axi_interconnect_0/M06_AXI]
connect_bd_net -net SimpleSine_0_interrupt [get_bd_pins audio_components/simplesine_interrupt] \
  [get_bd_ports intr2] [get_bd_pins processor/simplesine_int]
connect_bd_net [get_bd_pins audio_components/multisine_interrupt] [get_bd_ports intr3] [get_bd_pins processor/multisine_int]
connect_bd_net [get_bd_pins audio_components/simpleSineMaster_interrupt] [get_bd_pins processor/simplesinemaster_int]
connect_bd_net -net axi_cdma_0_cdma_introut [get_bd_pins audio_components/cdma_introut] [get_bd_pins processor/cdma_int]
connect_bd_net -net axi_uartlite_0_interrupt [get_bd_pins outputs/uart_int] [get_bd_pins processor/uart_int]
connect_bd_net [get_bd_pins clk_gen/clk_100] \
  [get_bd_pins axi_interconnect_0/M05_ACLK] [get_bd_pins axi_interconnect_0/ACLK] [get_bd_pins axi_interconnect_0/M00_ACLK] \
  [get_bd_pins audio_components/s_axi_lite_aclk] [get_bd_pins axi_interconnect_0/M01_ACLK] \
  [get_bd_pins axi_interconnect_0/M02_ACLK] [get_bd_pins axi_interconnect_0/M03_ACLK] \
  [get_bd_pins axi_interconnect_0/M06_ACLK] [get_bd_pins axi_interconnect_0/M07_ACLK] \
  [get_bd_pins axi_interconnect_0/S00_ACLK] [get_bd_pins axi_interconnect_0/S01_ACLK] [get_bd_pins memory/LMB_Clk] \
  [get_bd_pins outputs/s_axi_aclk] [get_bd_pins processor/s_axi_aclk] [get_bd_pins axi_interconnect_0/M08_ACLK] \
  [get_bd_pins axi_interconnect_0/S02_ACLK]
connect_bd_net [get_bd_pins clk_gen/clk_300] [get_bd_pins axi_interconnect_0/M04_ACLK] [get_bd_pins outputs/s_axi_aclk1]
connect_bd_net [get_bd_pins clk_gen/clk_audio] [get_bd_pins outputs/audioClkIn]
connect_bd_net -net mdm_1_debug_sys_rst [get_bd_pins processor/Debug_SYS_Rst] [get_bd_pins clk_gen/mb_debug_sys_rst]
connect_bd_net [get_bd_pins outputs/bclkOut] [get_bd_ports bclkOut]
connect_bd_net [get_bd_pins outputs/lrclkOut] [get_bd_ports lrclkOut]
connect_bd_net [get_bd_pins outputs/mclkOut] [get_bd_ports mclkOut]
connect_bd_net -net outputs_moreDataNeededInterrupt_0 [get_bd_pins outputs/is2_int] [get_bd_ports intr1] [get_bd_pins processor/i2s_int]
connect_bd_net -net outputs_sdataOut_0 [get_bd_pins outputs/dataOut] [get_bd_ports dataOut]
connect_bd_net [get_bd_ports reset] [get_bd_pins clk_gen/reset]
connect_bd_net -net rst_clk_wiz_1_100M_bus_struct_reset [get_bd_pins clk_gen/bus_struct_reset] [get_bd_pins memory/SYS_Rst]
connect_bd_net -net rst_clk_wiz_1_100M_mb_reset [get_bd_pins clk_gen/mb_reset] [get_bd_pins processor/Reset]
connect_bd_net -net rst_clk_wiz_1_100M_peripheral_aresetn [get_bd_pins clk_gen/peripheral_aresetn] \
  [get_bd_pins memory/ARESETN] [get_bd_pins audio_components/s_axi_aresetn] [get_bd_pins axi_interconnect_0/M00_ARESETN] \
  [get_bd_pins axi_interconnect_0/M01_ARESETN] [get_bd_pins axi_interconnect_0/M02_ARESETN] \
  [get_bd_pins axi_interconnect_0/M03_ARESETN] [get_bd_pins axi_interconnect_0/M04_ARESETN] \
  [get_bd_pins axi_interconnect_0/S00_ARESETN] [get_bd_pins axi_interconnect_0/S01_ARESETN] \
  [get_bd_pins axi_interconnect_0/M05_ARESETN] [get_bd_pins axi_interconnect_0/M06_ARESETN] \
  [get_bd_pins axi_interconnect_0/ARESETN] [get_bd_pins axi_interconnect_0/M07_ARESETN] [get_bd_pins outputs/s_axi_aresetn] \
  [get_bd_pins processor/s_axi_aresetn] [get_bd_pins axi_interconnect_0/M08_ARESETN] \
  [get_bd_pins axi_interconnect_0/S02_ARESETN]
connect_bd_net -net sys_clock_1 [get_bd_ports sysclk] [get_bd_pins clk_gen/sys_clock]

# ---- address map ----
assign_bd_address -offset 0x00010000 -range 64K -target_address_space [get_bd_addr_spaces audio_components/audio_bram/axi_cdma_0/Data] [get_bd_addr_segs audio_components/MultiSine_0/s_axi_BUS_A/Reg]
assign_bd_address -offset 0x00020000 -range 64K -target_address_space [get_bd_addr_spaces audio_components/audio_bram/axi_cdma_0/Data] [get_bd_addr_segs audio_components/SimpleSine_0/s_axi_BUS_A/Reg]
assign_bd_address -offset 0xC0000000 -range 8K -target_address_space [get_bd_addr_spaces audio_components/audio_bram/axi_cdma_0/Data] [get_bd_addr_segs audio_components/audio_bram/audio_bram/axi_bram_ctrl_0/S_AXI/Mem0]
exclude_bd_addr_seg -offset 0x00000000 -range 64K -target_address_space [get_bd_addr_spaces audio_components/audio_bram/axi_cdma_0/Data] [get_bd_addr_segs audio_components/SimpleSineMaster_0/s_axi_control/Reg]
exclude_bd_addr_seg -offset 0x40000000 -range 64K -target_address_space [get_bd_addr_spaces audio_components/audio_bram/axi_cdma_0/Data] [get_bd_addr_segs outputs/axi_gpio_0/S_AXI/Reg]
exclude_bd_addr_seg -offset 0x40600000 -range 64K -target_address_space [get_bd_addr_spaces audio_components/audio_bram/axi_cdma_0/Data] [get_bd_addr_segs outputs/axi_uartlite_0/S_AXI/Reg]
exclude_bd_addr_seg -offset 0x41200000 -range 64K -target_address_space [get_bd_addr_spaces audio_components/audio_bram/axi_cdma_0/Data] [get_bd_addr_segs processor/microblaze_0_axi_intc/S_AXI/Reg]
exclude_bd_addr_seg -offset 0x41C00000 -range 64K -target_address_space [get_bd_addr_spaces audio_components/audio_bram/axi_cdma_0/Data] [get_bd_addr_segs processor/axi_timer_0/S_AXI/Reg]
exclude_bd_addr_seg -offset 0x44A00000 -range 64K -target_address_space [get_bd_addr_spaces audio_components/audio_bram/axi_cdma_0/Data] [get_bd_addr_segs audio_components/audio_bram/axi_cdma_0/S_AXI_LITE/Reg]
assign_bd_address -offset 0xC0000000 -range 8K -target_address_space [get_bd_addr_spaces audio_components/SimpleSineMaster_0/Data_m_axi_gmem] [get_bd_addr_segs audio_components/audio_bram/audio_bram/axi_bram_ctrl_0/S_AXI/Mem0]
exclude_bd_addr_seg -offset 0x00000000 -range 64K -target_address_space [get_bd_addr_spaces audio_components/SimpleSineMaster_0/Data_m_axi_gmem] [get_bd_addr_segs audio_components/SimpleSineMaster_0/s_axi_control/Reg]
exclude_bd_addr_seg -offset 0x00010000 -range 64K -target_address_space [get_bd_addr_spaces audio_components/SimpleSineMaster_0/Data_m_axi_gmem] [get_bd_addr_segs audio_components/MultiSine_0/s_axi_BUS_A/Reg]
exclude_bd_addr_seg -offset 0x00020000 -range 64K -target_address_space [get_bd_addr_spaces audio_components/SimpleSineMaster_0/Data_m_axi_gmem] [get_bd_addr_segs audio_components/SimpleSine_0/s_axi_BUS_A/Reg]
exclude_bd_addr_seg -offset 0x40000000 -range 64K -target_address_space [get_bd_addr_spaces audio_components/SimpleSineMaster_0/Data_m_axi_gmem] [get_bd_addr_segs outputs/axi_gpio_0/S_AXI/Reg]
exclude_bd_addr_seg -offset 0x40600000 -range 64K -target_address_space [get_bd_addr_spaces audio_components/SimpleSineMaster_0/Data_m_axi_gmem] [get_bd_addr_segs outputs/axi_uartlite_0/S_AXI/Reg]
exclude_bd_addr_seg -offset 0x41200000 -range 64K -target_address_space [get_bd_addr_spaces audio_components/SimpleSineMaster_0/Data_m_axi_gmem] [get_bd_addr_segs processor/microblaze_0_axi_intc/S_AXI/Reg]
exclude_bd_addr_seg -offset 0x41C00000 -range 64K -target_address_space [get_bd_addr_spaces audio_components/SimpleSineMaster_0/Data_m_axi_gmem] [get_bd_addr_segs processor/axi_timer_0/S_AXI/Reg]
exclude_bd_addr_seg -offset 0x44A00000 -range 64K -target_address_space [get_bd_addr_spaces audio_components/SimpleSineMaster_0/Data_m_axi_gmem] [get_bd_addr_segs audio_components/audio_bram/axi_cdma_0/S_AXI_LITE/Reg]
assign_bd_address -offset 0x00000000 -range 8K -target_address_space [get_bd_addr_spaces processor/microblaze_0/Data] [get_bd_addr_segs memory/microblaze_0_local_memory/dlmb_bram_if_cntlr/SLMB/Mem]
assign_bd_address -offset 0x00008000 -range 32K -target_address_space [get_bd_addr_spaces processor/microblaze_0/Data] [get_bd_addr_segs audio_components/SimpleSineMaster_0/s_axi_control/Reg]
assign_bd_address -offset 0x00010000 -range 64K -target_address_space [get_bd_addr_spaces processor/microblaze_0/Data] [get_bd_addr_segs audio_components/MultiSine_0/s_axi_BUS_A/Reg]
assign_bd_address -offset 0x00020000 -range 64K -target_address_space [get_bd_addr_spaces processor/microblaze_0/Data] [get_bd_addr_segs audio_components/SimpleSine_0/s_axi_BUS_A/Reg]
assign_bd_address -offset 0x40000000 -range 64K -target_address_space [get_bd_addr_spaces processor/microblaze_0/Data] [get_bd_addr_segs outputs/axi_gpio_0/S_AXI/Reg]
assign_bd_address -offset 0x40600000 -range 64K -target_address_space [get_bd_addr_spaces processor/microblaze_0/Data] [get_bd_addr_segs outputs/axi_uartlite_0/S_AXI/Reg]
assign_bd_address -offset 0x41200000 -range 64K -target_address_space [get_bd_addr_spaces processor/microblaze_0/Data] [get_bd_addr_segs processor/microblaze_0_axi_intc/S_AXI/Reg]
assign_bd_address -offset 0x41C00000 -range 64K -target_address_space [get_bd_addr_spaces processor/microblaze_0/Data] [get_bd_addr_segs processor/axi_timer_0/S_AXI/Reg]
assign_bd_address -offset 0x44A00000 -range 64K -target_address_space [get_bd_addr_spaces processor/microblaze_0/Data] [get_bd_addr_segs audio_components/audio_bram/axi_cdma_0/S_AXI_LITE/Reg]
assign_bd_address -offset 0x60000000 -range 512K -target_address_space [get_bd_addr_spaces processor/microblaze_0/Data] [get_bd_addr_segs memory/emc_memory/axi_emc_0/S_AXI_MEM/MEM0]
assign_bd_address -offset 0xC0000000 -range 8K -target_address_space [get_bd_addr_spaces processor/microblaze_0/Data] [get_bd_addr_segs audio_components/audio_bram/audio_bram/axi_bram_ctrl_0/S_AXI/Mem0]
assign_bd_address -offset 0x00000000 -range 8K -target_address_space [get_bd_addr_spaces processor/microblaze_0/Instruction] [get_bd_addr_segs memory/microblaze_0_local_memory/ilmb_bram_if_cntlr/SLMB/Mem]
assign_bd_address -offset 0x60000000 -range 512K -target_address_space [get_bd_addr_spaces processor/microblaze_0/Instruction] [get_bd_addr_segs memory/emc_memory/axi_emc_0/S_AXI_MEM/MEM0]

validate_bd_design
save_bd_design
